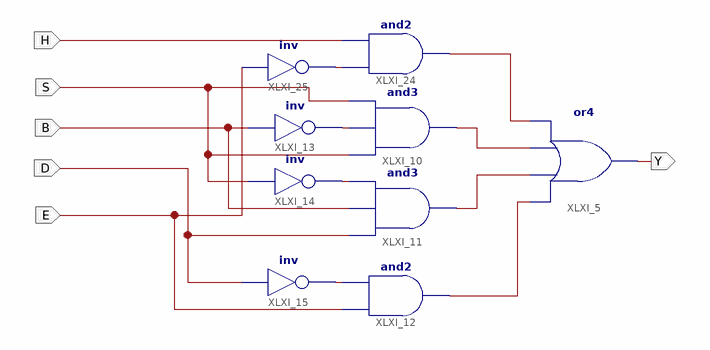
[diagram p0: schematic sheet 1]
// Xilinx ISE schematic Scheme1.sch (spartan6) as structural Verilog: 9 symbols, 6 ports
module Scheme1 (
  input  H,
  input  S,
  input  B,
  input  D,
  input  E,
  output Y
);

  wire XLXN_3, XLXN_4, XLXN_5, XLXN_6, XLXN_8, XLXN_9, XLXN_10, XLXN_30;

  or XLXI_5 (Y, XLXN_6, XLXN_5, XLXN_4, XLXN_3);
  and XLXI_10 (XLXN_4, S, XLXN_8, S);
  and XLXI_11 (XLXN_5, D, B, XLXN_9);
  and XLXI_12 (XLXN_6, E, XLXN_10);
  not XLXI_13 (XLXN_8, B);
  not XLXI_14 (XLXN_9, S);
  not XLXI_15 (XLXN_10, D);
  and XLXI_24 (XLXN_3, XLXN_30, H);
  not XLXI_25 (XLXN_30, E);
endmodule
